# Altium schematic sheet GPIO_Raspberry_b+.SchDoc
size A4
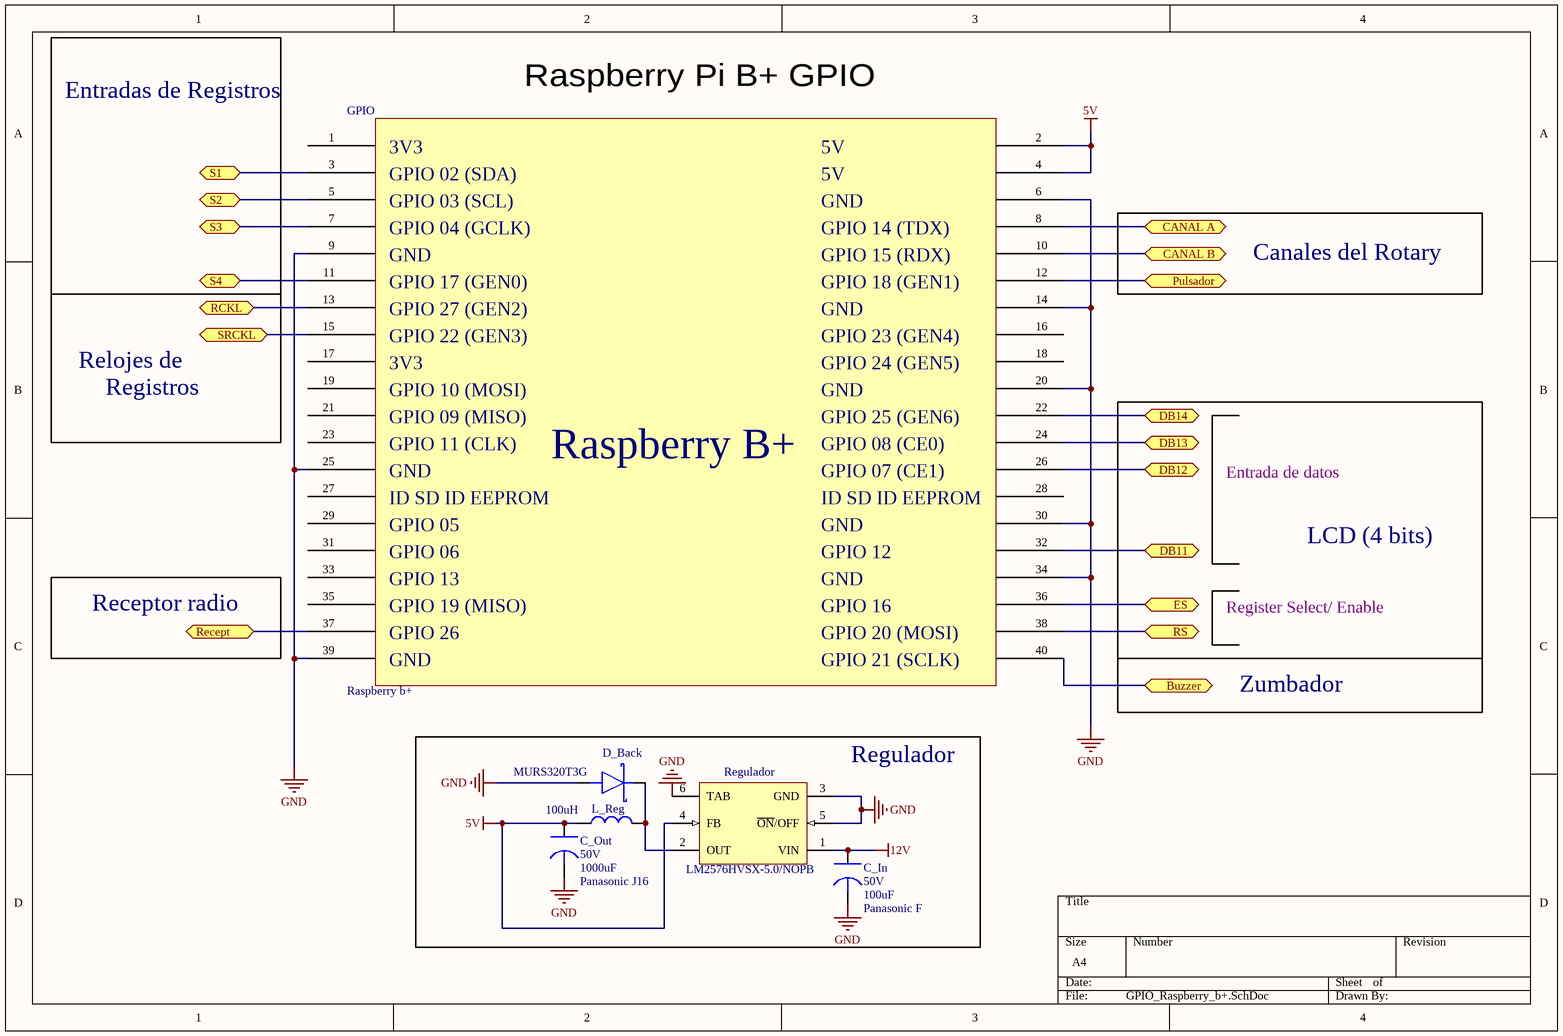
[diagram p0: GPIO_Raspberry_b+.SchDoc]

## Parts
C_In  value 100uF  Voltage Rating: 50V  PCB DECAL: Panasonic F  [Panasonic F Size]  (hidden comment: Panasonic 100uF)
C_Out  value 1000uF  Voltage Rating: 50V  PCB DECAL: Panasonic J16  [Panasonic J16 Size]  (hidden comment: Panasonic 1000uF)
D_Back  MURS320T3G  [DO-214AB]
GPIO  Raspberry b+  [Raspberry]
L_Reg  value 100uH  [DO-5040H 15uH-1400uH]  (hidden comment: DO-5040H-104ML_)
Regulador  LM2576HVSX-5.0/NOPB  [TS5B_N_]

## Blocks framed on the sheet
Regulador: C_In C_Out D_Back L_Reg Regulador

## Ports
Buzzer, CANAL A, CANAL B, DB11, DB12, DB13, DB14, ES, Pulsador, RCKL, Recept, RS, S1, S2, S3, S4, SRCKL

## Nets
5V: C_Out.1 GPIO.2 GPIO.4 L_Reg.1 Regulador.4(FB)
12V: C_In.1 Regulador.1(VIN)
GND: C_In.2 C_Out.2 D_Back.A GPIO.6 GPIO.9 GPIO.14 GPIO.20 GPIO.25 GPIO.30 GPIO.34 GPIO.39 Regulador.3(GND) Regulador.5(~{ON}/OFF) Regulador.6(TAB)
Buzzer: GPIO.40 ; port Buzzer
CANAL A: GPIO.8 ; port CANAL A
CANAL B: GPIO.10 ; port CANAL B
DB11: GPIO.32 ; port DB11
DB12: GPIO.26 ; port DB12
DB13: GPIO.24 ; port DB13
DB14: GPIO.22 ; port DB14
ES: GPIO.36 ; port ES
Pulsador: GPIO.12 ; port Pulsador
RCKL: GPIO.13 ; port RCKL
Recept: GPIO.37 ; port Recept
RS: GPIO.38 ; port RS
S1: GPIO.3 ; port S1
S2: GPIO.5 ; port S2
S3: GPIO.7 ; port S3
S4: GPIO.11 ; port S4
SRCKL: GPIO.15 ; port SRCKL
NetD_Back_K: D_Back.K L_Reg.2 Regulador.2(OUT)

Not connected (* = marked no-connect by the designer): GPIO 1 16 17 18 19 21 23 27 28 29 31 33 35

## Notes on the sheet
- (near GPIO) Entradas de Registros
- (near GPIO) Raspberry Pi B+ GPIO
- Canales del Rotary
- Relojes de
- Registros
- Entrada de datos
- LCD (4 bits)
- Receptor radio
- Register Select/ Enable
- Zumbador
- (in symbol Raspberry b+) 3V3; 5V; GPIO 02 (SDA); GPIO 03 (SCL); GND; GPIO 04 (GCLK); GPIO 14 (TDX); GPIO 15 (RDX); GPIO 17 (GEN0); GPIO 18 (GEN1); GPIO 27 (GEN2); GPIO 22 (GEN3); GPIO 23 (GEN4); GPIO 24 (GEN5); GPIO 10 (MOSI); GPIO 09 (MISO); GPIO 25 (GEN6); GPIO 11 (CLK); GPIO 08 (CE0); Raspberry B+; GPIO 07 (CE1); ID SD ID EEPROM; GPIO 05; GPIO 06; GPIO 12; GPIO 13; GPIO 19 (MISO); GPIO 16; GPIO 26; GPIO 20 (MOSI); GPIO 21 (SCLK)

## Library data of the parts
C_In = Panasonic 100uF: Condensador Electrolítico SMD; Manufacturer #1: Nippon Chemi-Con; Part Number: EMV-500ADA101MJA0G; Tolerance: 20%; Ref. Mafero: 230; Author: Jaime Jiménez Ortega; Cost: 0,718€; Date: 21/05/2009; Distributor: RS; Ref Distributor: 5479063
C_Out = Panasonic 1000uF: Condensador Electrolítico SMD; Manufacturer #1: Nippon Chemi-Con; Part Number: EMV-500ADA101MJA0G; Tolerance: 20%; Ref. Mafero: 230; Author: Jaime Jiménez Ortega; Cost: 0,718€; Date: 21/05/2009; Distributor: RS; Ref Distributor: 5479063
D_Back = MURS320T3G: Surface Mount Schottky-Rectifiers; Manufacturer #1: On Semiconductor; Ref. Mafero: 1171; Author: Jaime Jiménez Ortega; Date: 22/05/2009; Distributor: Farnell; Part Number: MURS320T3G; Ref Distributor: 9557555; PCB DECAL: DO-214AB
L_Reg = Inductor: Manufacturer #1: CoilCraft; Part Number: DO5040H-104ML_; Ref. Mafero: 1611; Author: Jaime Jiménez Ortega; Date: 22/05/2009; Distributor: Sagitron; Ref Distributor: DO5040H-104ML_; PCB DECAL: DO-5040H 15uH-1400uH
Regulador = LM2576HVSX-5.0/NOPB: SIMPLE SWITCHER® 3A Step-Down Voltage Regulator, 5-pin TO-263, Pb-Free; Manufacturer: National Semiconductor; PackageTopMarking: NSUZXYTTE#*LM2576*HVS-5.0 P+; PowerWise: N; Published: 1-Mar-2010; DatasheetVersion: Aug-2004; PackageVersion: revD, Apr-2005; PackageReference: TS5B; Publisher: Altium Limited; PackageDescription: TO-263, Molded, .400 x .390 x .180in, 5 Lead, .067in Pitch, Surface Mount; Supplier 1: Digi-Key; Supplier Part Number 1: LM2576HVSX-5.0-ND; PartNumber: LM2576HVSX-5.0/NOPB; RoHS: Y; PinCount: 5; CompType: Switcher; Code_JEDEC: MO-169-AB; ComponentLink1Description: LM2576HV Datasheet; ComponentLink1URL: http://www.national.com/ds/LM/LM2576HV.pdf; ComponentLink2Description: LM2576HV Web Page; ComponentLink2URL: http://www.national.com/pf/LM/LM2576HV.html; ComponentLink3Description: TS5B Package Page; ComponentLink3URL: http://www.national.com/packaging/folders/ts5b.html